# Altium schematic sheet PMI_Action_bumpers.SchDoc
size A4
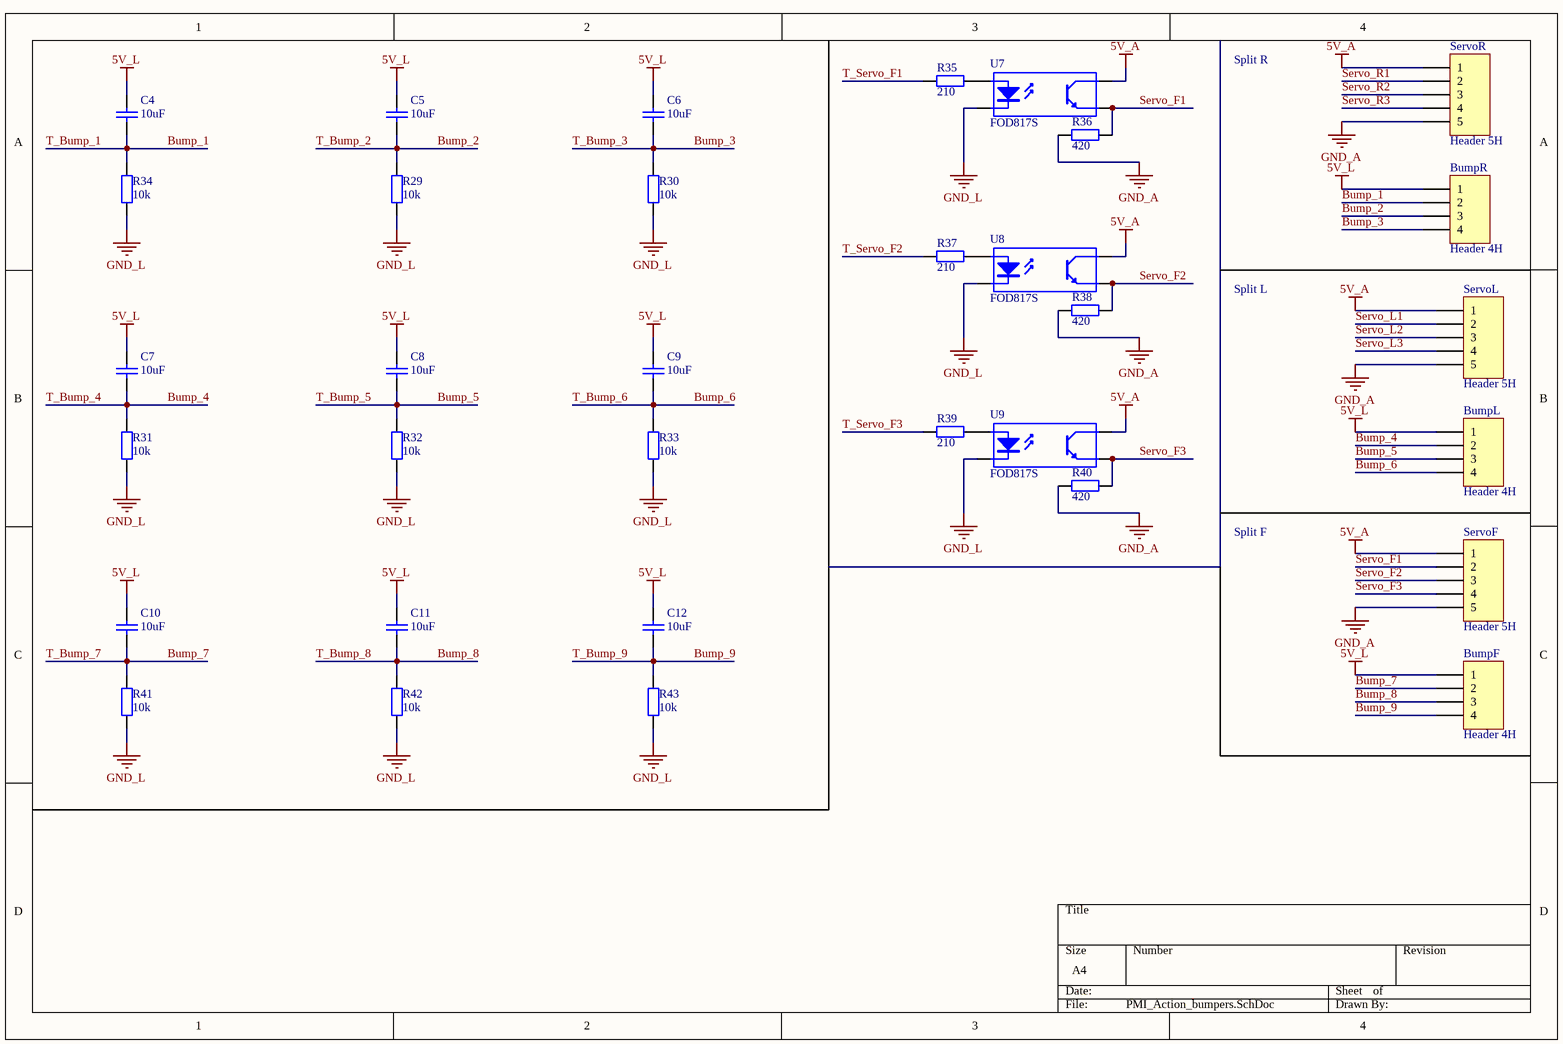
[diagram p0: PMI_Action_bumpers.SchDoc]

## Parts
BumpF  Header 4H  [S4B-XH-A]
BumpL  Header 4H  [S4B-XH-A]
BumpR  Header 4H  [S4B-XH-A]
C4  value 10uF  [Capacitor 1206]  (hidden comment: (optional))
C5  value 10uF  [Capacitor 1206]  (hidden comment: (optional))
C6  value 10uF  [Capacitor 1206]  (hidden comment: (optional))
C7  value 10uF  [Capacitor 1206]  (hidden comment: (optional))
C8  value 10uF  [Capacitor 1206]  (hidden comment: (optional))
C9  value 10uF  [Capacitor 1206]  (hidden comment: (optional))
C10  value 10uF  [Capacitor 1206]  (hidden comment: (optional))
C11  value 10uF  [Capacitor 1206]  (hidden comment: (optional))
C12  value 10uF  [Capacitor 1206]  (hidden comment: (optional))
R29  value 10k  [Resistor 1206]  (hidden comment: Res2)
R30  value 10k  [Resistor 1206]  (hidden comment: Res2)
R31  value 10k  [Resistor 1206]  (hidden comment: Res2)
R32  value 10k  [Resistor 1206]  (hidden comment: Res2)
R33  value 10k  [Resistor 1206]  (hidden comment: Res2)
R34  value 10k  [Resistor 1206]  (hidden comment: Res2)
R35  value 210  [Resistor 1206]  (hidden comment: Res2)
R36  value 420  [Resistor 1206]  (hidden comment: Res2)
R37  value 210  [Resistor 1206]  (hidden comment: Res2)
R38  value 420  [Resistor 1206]  (hidden comment: Res2)
R39  value 210  [Resistor 1206]  (hidden comment: Res2)
R40  value 420  [Resistor 1206]  (hidden comment: Res2)
R41  value 10k  [Resistor 1206]  (hidden comment: Res2)
R42  value 10k  [Resistor 1206]  (hidden comment: Res2)
R43  value 10k  [Resistor 1206]  (hidden comment: Res2)
ServoF  Header 5H  [S5B-XH-A]
ServoL  Header 5H  [S5B-XH-A]
ServoR  Header 5H  [S5B-XH-A]
U7  FOD817S  [SOP254P1016X385-4N]
U8  FOD817S  [SOP254P1016X385-4N]
U9  FOD817S  [SOP254P1016X385-4N]

## Nets
5V_A: ServoF.1 ServoL.1 ServoR.1 U7.4(C) U8.4(C) U9.4(C)
5V_L: BumpF.1 BumpL.1 BumpR.1 C4.2 C5.2 C6.2 C7.2 C8.2 C9.2 C10.2 C11.2 C12.2
GND_A: R36.2 R38.2 R40.2 ServoF.5 ServoL.5 ServoR.5
GND_L: R29.2 R30.2 R31.2 R32.2 R33.2 R34.2 R41.2 R42.2 R43.2 U7.2(K) U8.2(K) U9.2(K)
Bump_1: BumpR.2 C4.1 R34.1  [also labelled T_Bump_1]
Bump_2: BumpR.3 C5.1 R29.1  [also labelled T_Bump_2]
Bump_3: BumpR.4 C6.1 R30.1  [also labelled T_Bump_3]
Bump_4: BumpL.2 C7.1 R31.1  [also labelled T_Bump_4]
Bump_5: BumpL.3 C8.1 R32.1  [also labelled T_Bump_5]
Bump_6: BumpL.4 C9.1 R33.1  [also labelled T_Bump_6]
Bump_7: BumpF.2 C10.1 R41.1  [also labelled T_Bump_7]
Bump_8: BumpF.3 C11.1 R42.1  [also labelled T_Bump_8]
Bump_9: BumpF.4 C12.1 R43.1  [also labelled T_Bump_9]
Servo_F1: R36.1 ServoF.2 U7.3(E)
Servo_F2: R38.1 ServoF.3 U8.3(E)
Servo_F3: R40.1 ServoF.4 U9.3(E)
Servo_L1: ServoL.2
Servo_L2: ServoL.3
Servo_L3: ServoL.4
Servo_R1: ServoR.2
Servo_R2: ServoR.3
Servo_R3: ServoR.4
T_Servo_F1: R35.2
T_Servo_F2: R37.2
T_Servo_F3: R39.2
NetR35_1: R35.1 U7.1(A)
NetR37_1: R37.1 U8.1(A)
NetR39_1: R39.1 U9.1(A)

## Notes on the sheet
- Split R
- Split L
- Split F

## Library data of the parts
BumpF BumpL BumpR = Header 4H: Header, 4-Pin, Right Angle; LatestRevisionDate: 17-Jul-2002; LatestRevisionNote: Re-released for DXP Platform.; Publisher: Altium Limited
C4-C12 = Cap: Capacitor; Published: 8-Jun-2000; LatestRevisionDate: 17-Jul-2002; LatestRevisionNote: Re-released for DXP Platform.; PackageReference: RAD-0.3; Publisher: Altium Limited; PackageDescription: Radial Cap, Thru-Hole; 2 Leads; 0.3 in Pin Spacing
R29-R43 = Res2: Resistor; Published: 8-Jun-2000; LatestRevisionDate: 17-Jul-2002; LatestRevisionNote: Re-released for DXP Platform.; PackageReference: AXIAL-0.4; Publisher: Altium Limited; PackageDescription: Axial Device, Thru-Hole; 2 Leads; 0.4 in Pin Spacing
ServoF ServoL ServoR = Header 5H: Header, 5-Pin, Right Angle; LatestRevisionDate: 17-Jul-2002; LatestRevisionNote: Re-released for DXP Platform.; Publisher: Altium Limited
U7-U9 = Optoisolator1: 4-Pin Phototransistor Optocoupler; Published: 24-Mar-1999; LatestRevisionDate: 04-Mar-2005; LatestRevisionNote: Sch pins 3 & 4 Swapped.; DatasheetVersion: Nov-2003; PackageReference: DIP-4; Publisher: Altium Limited